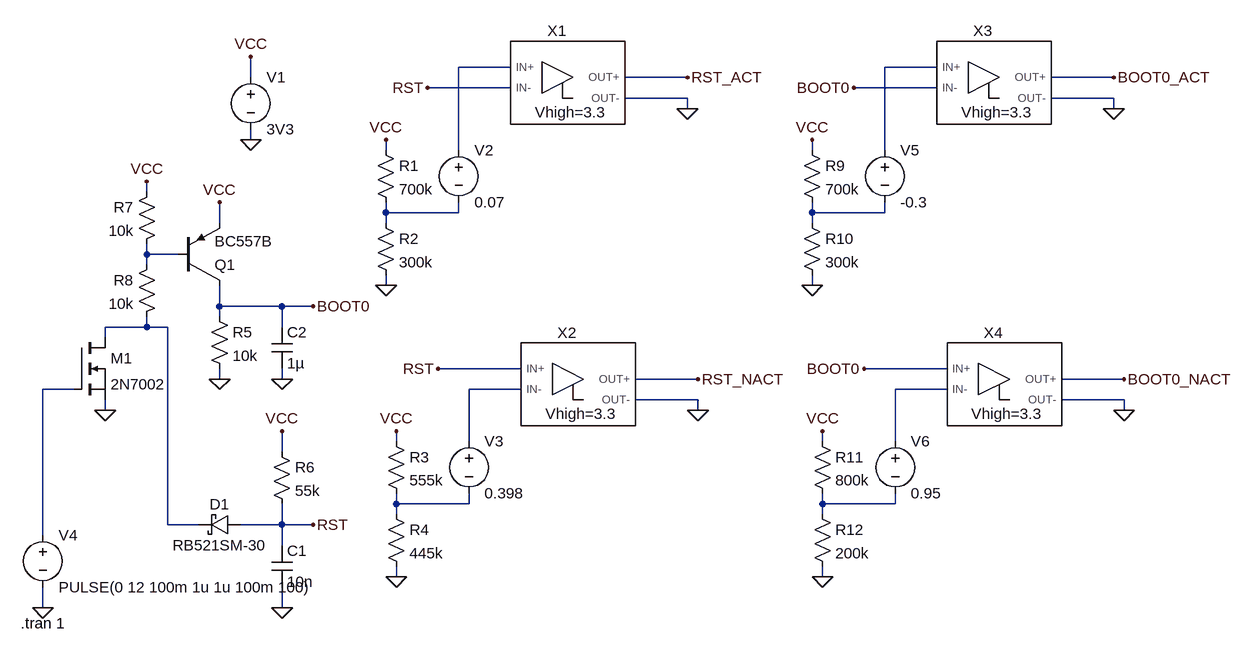
[diagram p0: schematic STM32_boot_button.asc]
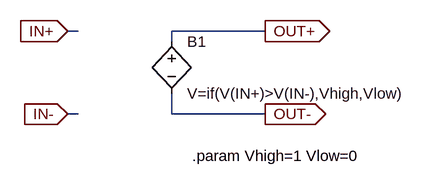
[diagram p1: sub-circuit comparator.asc]
STM32_boot_button.asc, the LTspice schematic file:
Version 4
SHEET 1 1444 888
WIRE 320 16 240 16
WIRE 976 16 896 16
WIRE -80 32 -80 0
WIRE 592 32 496 32
WIRE 1248 32 1152 32
WIRE 320 48 192 48
WIRE 976 48 848 48
WIRE 592 64 496 64
WIRE 1248 64 1152 64
WIRE 592 80 592 64
WIRE 1248 80 1248 64
WIRE -80 128 -80 112
WIRE 128 144 128 128
WIRE 240 144 240 16
WIRE 784 144 784 128
WIRE 896 144 896 16
WIRE -240 208 -240 192
WIRE 128 240 128 224
WIRE 240 240 240 224
WIRE 240 240 128 240
WIRE 784 240 784 224
WIRE 896 240 896 224
WIRE 896 240 784 240
WIRE -128 256 -128 224
WIRE 128 256 128 240
WIRE 784 256 784 240
WIRE -240 304 -240 288
WIRE -192 304 -240 304
WIRE -240 320 -240 304
WIRE 128 352 128 336
WIRE 784 352 784 336
WIRE -128 384 -128 352
WIRE -32 384 -128 384
WIRE 16 384 -32 384
WIRE -128 400 -128 384
WIRE -240 416 -240 400
WIRE -240 416 -304 416
WIRE -208 416 -240 416
WIRE -32 416 -32 384
WIRE -304 432 -304 416
WIRE 336 480 208 480
WIRE 992 480 864 480
WIRE -128 496 -128 480
WIRE -32 496 -32 480
WIRE 608 496 512 496
WIRE 1264 496 1168 496
WIRE -352 512 -400 512
WIRE 336 512 256 512
WIRE 992 512 912 512
WIRE 608 528 512 528
WIRE 1264 528 1168 528
WIRE -304 544 -304 528
WIRE 608 544 608 528
WIRE 1264 544 1264 528
WIRE 144 592 144 576
WIRE 256 592 256 512
WIRE 800 592 800 576
WIRE 912 592 912 512
WIRE -32 608 -32 576
WIRE 144 688 144 672
WIRE 256 688 256 672
WIRE 256 688 144 688
WIRE 800 688 800 672
WIRE 912 688 912 672
WIRE 912 688 800 688
WIRE 144 704 144 688
WIRE 800 704 800 688
WIRE -208 720 -208 416
WIRE -160 720 -208 720
WIRE -32 720 -32 688
WIRE -32 720 -96 720
WIRE 16 720 -32 720
WIRE -400 736 -400 512
WIRE -32 752 -32 720
WIRE 144 800 144 784
WIRE 800 800 800 784
WIRE -400 848 -400 816
WIRE -32 848 -32 816
FLAG -80 128 0
FLAG -80 0 VCC
FLAG 592 32 RST_ACT
FLAG 592 80 0
FLAG 128 128 VCC
FLAG 128 352 0
FLAG 192 48 RST
FLAG 608 496 RST_NACT
FLAG 608 544 0
FLAG 144 576 VCC
FLAG 144 800 0
FLAG 208 480 RST
FLAG -128 496 0
FLAG -32 496 0
FLAG -128 224 VCC
FLAG -32 576 VCC
FLAG -32 848 0
FLAG -240 192 VCC
FLAG -304 544 0
FLAG 16 720 RST
FLAG 16 384 BOOT0
FLAG -400 848 0
FLAG 1248 32 BOOT0_ACT
FLAG 1248 80 0
FLAG 784 128 VCC
FLAG 784 352 0
FLAG 1264 496 BOOT0_NACT
FLAG 1264 544 0
FLAG 800 576 VCC
FLAG 800 800 0
FLAG 864 480 BOOT0
FLAG 848 48 BOOT0
SYMBOL voltage -80 16 R0
WINDOW 123 0 0 Left 2
WINDOW 39 0 0 Left 2
SYMATTR InstName V1
SYMATTR Value 3V3
SYMBOL comparator 400 32 R0
WINDOW 39 12 69 Bottom 2
SYMATTR InstName X1
SYMATTR SpiceLine Vhigh=3.3
SYMBOL voltage 240 128 R0
WINDOW 123 0 0 Left 2
WINDOW 39 0 0 Left 2
SYMATTR InstName V2
SYMATTR Value 0.07
SYMBOL res 112 128 R0
SYMATTR InstName R1
SYMATTR Value 700k
SYMBOL res 112 240 R0
SYMATTR InstName R2
SYMATTR Value 300k
SYMBOL comparator 416 496 R0
WINDOW 39 12 69 Bottom 2
SYMATTR InstName X2
SYMATTR SpiceLine Vhigh=3.3
SYMBOL voltage 256 576 R0
WINDOW 123 0 0 Left 2
WINDOW 39 0 0 Left 2
SYMATTR InstName V3
SYMATTR Value 0.398
SYMBOL res 128 576 R0
SYMATTR InstName R3
SYMATTR Value 555k
SYMBOL res 128 688 R0
SYMATTR InstName R4
SYMATTR Value 445k
SYMBOL cap -48 752 R0
SYMATTR InstName C1
SYMATTR Value 10n
SYMBOL cap -48 416 R0
SYMATTR InstName C2
SYMATTR Value 1µ
SYMBOL res -144 384 R0
SYMATTR InstName R5
SYMATTR Value 10k
SYMBOL pnp -192 352 M180
SYMATTR InstName Q1
SYMATTR Value BC557B
SYMBOL schottky -96 704 R90
WINDOW 0 0 32 VBottom 2
WINDOW 3 32 32 VTop 2
SYMATTR InstName D1
SYMATTR Value RB521SM-30
SYMATTR Description Diode
SYMATTR Type diode
SYMBOL res -48 592 R0
SYMATTR InstName R6
SYMATTR Value 55k
SYMBOL res -224 192 M0
SYMATTR InstName R7
SYMATTR Value 10k
SYMBOL res -224 304 M0
SYMATTR InstName R8
SYMATTR Value 10k
SYMBOL nmos -352 432 R0
SYMATTR InstName M1
SYMATTR Value 2N7002
SYMBOL voltage -400 720 R0
WINDOW 123 0 0 Left 2
WINDOW 39 0 0 Left 2
SYMATTR InstName V4
SYMATTR Value PULSE(0 12 100m 1u 1u 100m 100)
SYMBOL comparator 1056 32 R0
WINDOW 39 12 69 Bottom 2
SYMATTR InstName X3
SYMATTR SpiceLine Vhigh=3.3
SYMBOL voltage 896 128 R0
WINDOW 123 0 0 Left 2
WINDOW 39 0 0 Left 2
SYMATTR InstName V5
SYMATTR Value -0.3
SYMBOL res 768 128 R0
SYMATTR InstName R9
SYMATTR Value 700k
SYMBOL res 768 240 R0
SYMATTR InstName R10
SYMATTR Value 300k
SYMBOL comparator 1072 496 R0
WINDOW 39 12 69 Bottom 2
SYMATTR InstName X4
SYMATTR SpiceLine Vhigh=3.3
SYMBOL voltage 912 576 R0
WINDOW 123 0 0 Left 2
WINDOW 39 0 0 Left 2
SYMATTR InstName V6
SYMATTR Value 0.95
SYMBOL res 784 576 R0
SYMATTR InstName R11
SYMATTR Value 800k
SYMBOL res 784 688 R0
SYMATTR InstName R12
SYMATTR Value 200k
TEXT -434 872 Left 2 !.tran 1

comparator.asc, the sub-circuit schematic file:
Version 4
SHEET 1 880 680
WIRE 64 64 48 64
WIRE 352 64 208 64
WIRE 208 80 208 64
WIRE 64 192 48 192
WIRE 208 192 208 160
WIRE 352 192 208 192
FLAG 48 64 IN+
IOPIN 48 64 In
FLAG 48 192 IN-
IOPIN 48 192 In
FLAG 352 64 OUT+
IOPIN 352 64 Out
FLAG 352 192 OUT-
IOPIN 352 192 Out
SYMBOL bv 208 64 R0
SYMATTR InstName B1
SYMATTR Value V=if(V(IN+)>V(IN-),Vhigh,Vlow)
TEXT 240 256 Left 2 !.param Vhigh=1 Vlow=0

The netlist it stands for:
* STM32_boot_button.asc
V1 VCC 0 3V3
XX1 N001 RST RST_ACT 0 comparator params: Vhigh=3.3
V2 N001 N003 0.07
R1 VCC N003 700k
R2 N003 0 300k
XX2 RST N008 RST_NACT 0 comparator params: Vhigh=3.3
V3 N008 N010 0.398
R3 VCC N010 555k
R4 N010 0 445k
C1 RST 0 10n
C2 BOOT0 0 1µ
R5 BOOT0 0 10k
Q1 BOOT0 N005 VCC 0 BC557B
D1 RST N006 RB521SM-30
R6 VCC RST 55k
R7 VCC N005 10k
R8 N005 N006 10k
M1 N006 N007 0 0 2N7002
V4 N007 0 PULSE(0 12 100m 1u 1u 100m 100)
XX3 N002 BOOT0 BOOT0_ACT 0 comparator params: Vhigh=3.3
V5 N002 N004 -0.3
R9 VCC N004 700k
R10 N004 0 300k
XX4 BOOT0 N009 BOOT0_NACT 0 comparator params: Vhigh=3.3
V6 N009 N011 0.95
R11 VCC N011 800k
R12 N011 0 200k

* block symbol definitions
.subckt comparator IN+ IN- OUT+ OUT-
B1 OUT+ OUT- V=if(V(IN+)>V(IN-),Vhigh,Vlow)
.param Vhigh=1 Vlow=0
.ends comparator

.model D D
.lib standard.dio
.model NPN NPN
.model PNP PNP
.lib standard.bjt
.model NMOS NMOS
.model PMOS PMOS
.lib standard.mos
.tran 1
.backanno
.end